# EAGLE design cryoShield (EAGLE 7.1.0)
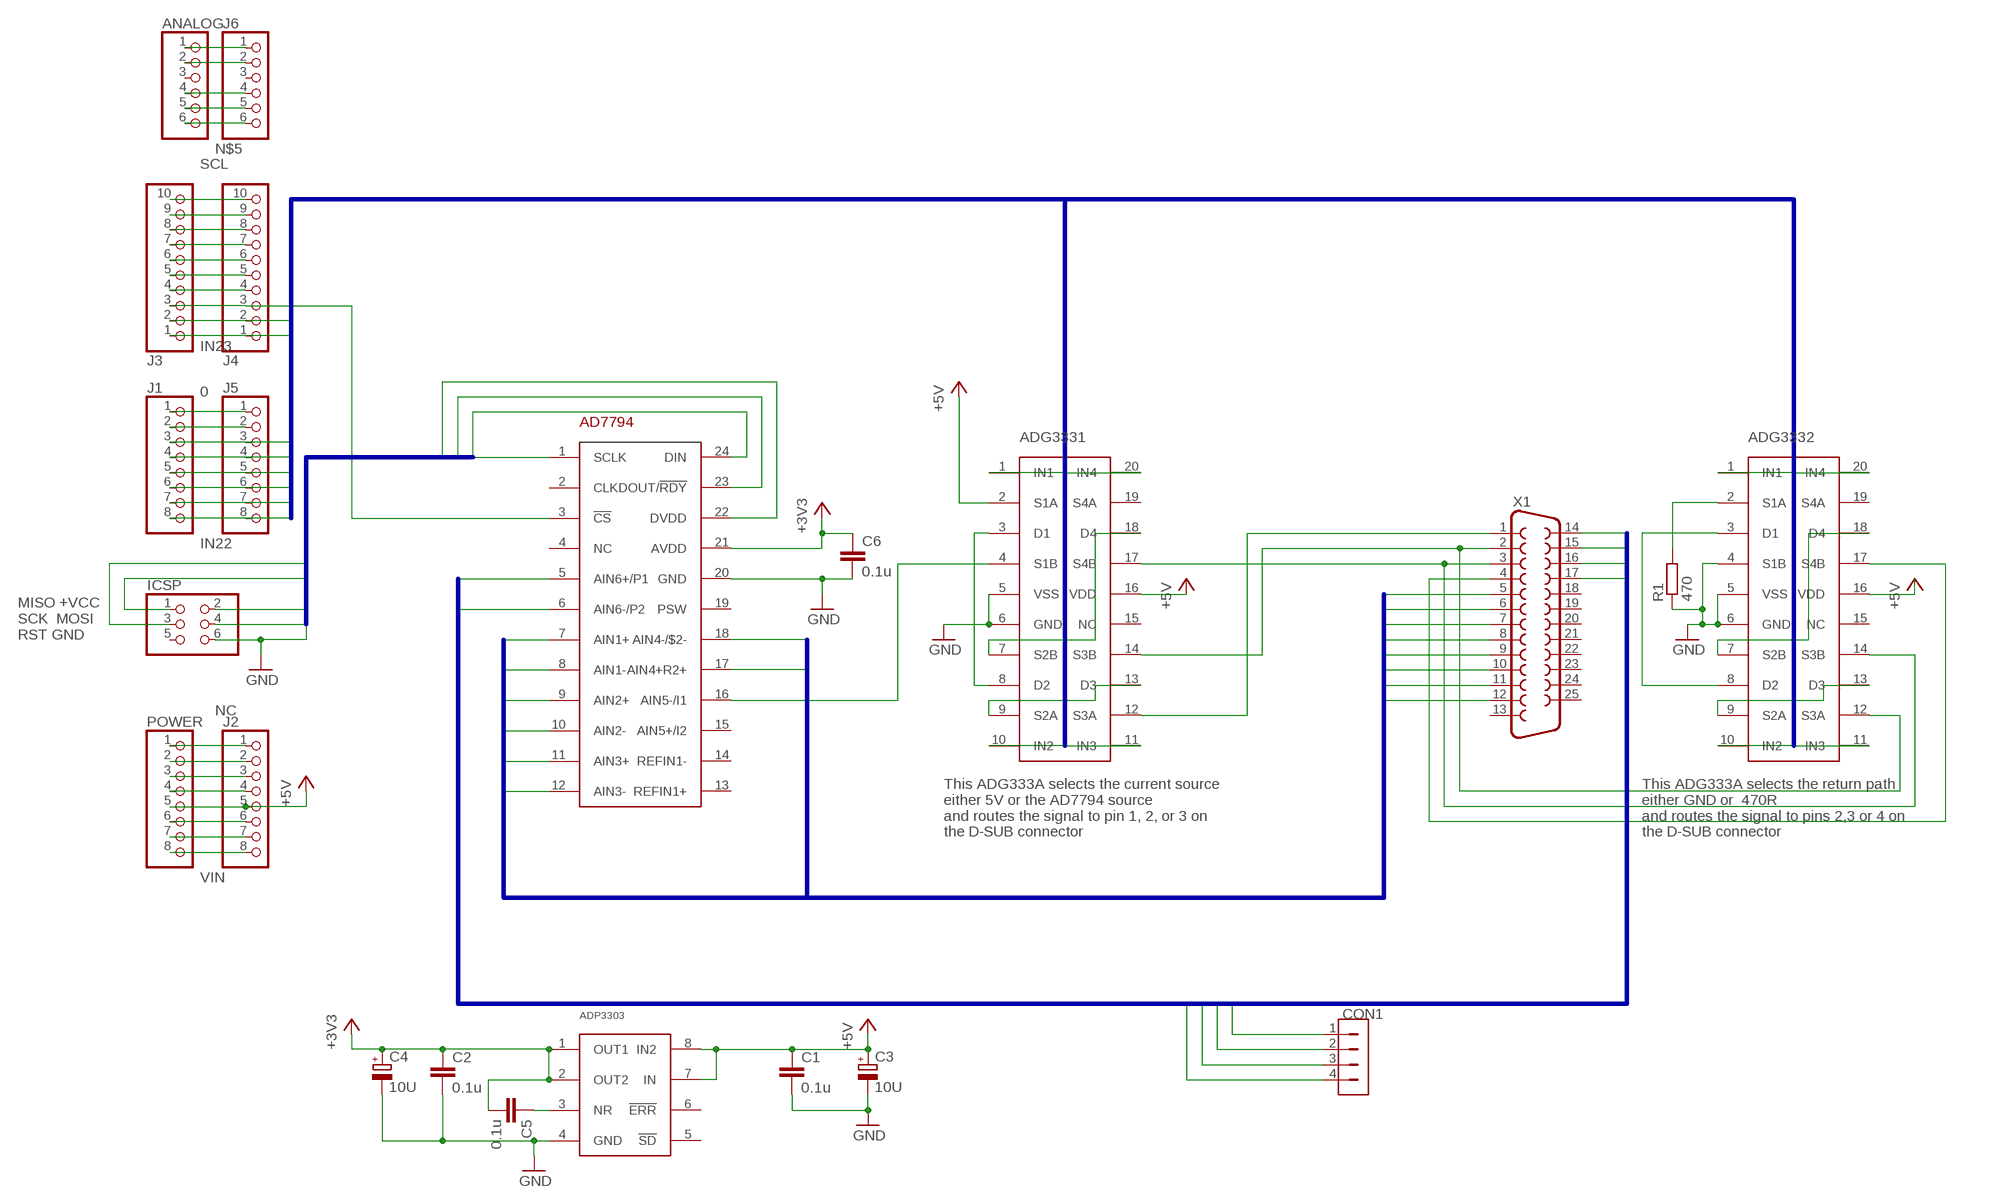
[diagram p0: schematic, sheet 1]

## Parts
AD7794  AD7794  [TSSOP24]
ADG3331  ADG333  [SOIC20S]
ADG3332  ADG333  [SOIC20S]
ADP3303  ADP3303  [SOIC8]
ANALOG  PINHD-1X6  [1X06]
C1  0.1u  C-EUC0805  [C0805]
C2  0.1u  C-EUC0805  [C0805]
C3  10U  CPOL1206  [CPOL1206]
C4  10U  CPOL1206  [CPOL1206]
C5  0.1u  C-EUC0805  [C0805]
C6  0.1u  C-EUC0805  [C0805]
CON1  MICROCLASP4  [MICROCLASP4]
ICSP  PINHD-2X3  [2X03]
J1  PINHD-1X8TH  [1X08-TH]
J2  PINHD-1X8TH  [1X08-TH]
J3  PINHD-1X10TH  [1X10-TH]
J4  PINHD-1X10TH  [1X10-TH]
J5  PINHD-1X8TH  [1X08-TH]
J6  PINHD-1X6  [1X06]
POWER  PINHD-1X8TH  [1X08-TH]
R1  470  R-EU_0207/10  [0207/10]
X1  F25H  [F25H]

## Nets
0: J1.1 J5.1
1: J1.2 J5.2
+3V3: AD7794.21(AVDD) ADP3303.1(OUT1) ADP3303.2(OUT2) C2.1 C4.1(+) C5.2 C6.1 J2.4 POWER.4
+5V: ADG3331.2(S1A) ADG3331.16(VDD) ADG3332.16(VDD) ADP3303.7(IN) ADP3303.8(IN2) C1.1 C3.1(+) J2.5 POWER.5
A0: ANALOG.1 J6.1
A1: ANALOG.2 J6.2
A3: ANALOG.4 J6.4
ADG3332: ADG3332.7(S2B) ADG3332.18(D4)
AIN1+: AD7794.7(AIN1+) X1.5
AIN1-: AD7794.8(AIN1-) X1.6
AIN2+: AD7794.9(AIN2+) X1.7
AIN2-: AD7794.10(AIN2-) X1.8
AIN3+: AD7794.11(AIN3+) X1.9
AIN3-: AD7794.12(AIN3-) X1.10
AIN4+: AD7794.17(AIN4+R2+) X1.11
AIN4-: AD7794.18(AIN4-/$2-) X1.12
AIN6+: AD7794.5(AIN6+/P1) CON1.3 X1.16
AIN6-: AD7794.6(AIN6-/P2) CON1.4 X1.17
CERNOXHIGH: CON1.1 X1.14
CERNOXLOW: CON1.2 X1.15
GND: AD7794.20(GND) ADG3331.5(VSS) ADG3331.6(GND) ADG3332.4(S1B) ADG3332.5(VSS) ADG3332.6(GND) ADP3303.4(GND) C1.2 C2.2 C3.2(-) C4.2(-) C6.2 ICSP.6 J2.6 J2.7 J3.7 J4.7 POWER.6 POWER.7 R1.1
IN11: ADG3331.1(IN1) J1.3 J5.3
IN12: ADG3331.10(IN2) J1.4 J5.4
IN13: ADG3331.11(IN3) J1.5 J5.5
IN14: ADG3331.20(IN4) J1.6 J5.6
IN21: ADG3332.1(IN1) J1.7 J5.7
IN22: ADG3332.10(IN2) J1.8 J5.8
IN23: ADG3332.11(IN3) J3.1 J4.1
IN24: ADG3332.20(IN4) J3.2 J4.2
IOREF: J2.2 POWER.2
MISO: AD7794.23(DOUT/!RDY) ICSP.1
MOSI: AD7794.24(DIN) ICSP.4
N$2: ADG3331.14(S3B) ADG3332.12(S3A) X1.2
N$3: ADG3331.3(D1) ADG3331.8(D2)
N$4: ANALOG.5 J6.5
N$5: ANALOG.6 J6.6
N$6: ADG3331.9(S2A) ADG3331.13(D3)
N$9: ADG3331.7(S2B) ADG3331.18(D4)
N$10: ADG3331.12(S3A) X1.1
N$11: ADG3331.17(S4B) ADG3332.14(S3B) X1.3
N$12: ADG3332.2(S1A) R1.2
N$13: ADG3332.3(D1) ADG3332.8(D2)
N$14: ADG3332.9(S2A) ADG3332.13(D3)
N$16: AD7794.16(AIN5-/I1) ADG3331.4(S1B)
N$17: ADP3303.3(NR) C5.1
N$18: ADG3332.17(S4B) X1.4
N$21: AD7794.3(!CS) J3.3 J4.3
N$22: J3.4 J4.4
N$23: J3.5 J4.5
N$24: J3.6 J4.6
N$26: J3.8 J4.8
NC: J2.1 POWER.1
RESET: J2.3 POWER.3
SCK: AD7794.1(SCLK) ICSP.3
SCL: J3.10 J4.10
SDA: J3.9 J4.9
VCC: AD7794.22(DVDD) ICSP.2
VIN: J2.8 POWER.8
Unconnected: AD7794.2(CLK) AD7794.4(NC) AD7794.13(REFIN1+) AD7794.14(REFIN1-) AD7794.15(AIN5+/I2) AD7794.19(PSW) ADG3331.15(NC) ADG3331.19(S4A) ADG3332.15(NC) ADG3332.19(S4A) ADP3303.5(!SD) ADP3303.6(!ERR) ANALOG.3 ICSP.5 J6.3 X1.13 X1.18 X1.19 X1.20 X1.21 X1.22 X1.23 X1.24 X1.25

## Buses
MISO,VCC,MOSI,SCK,RST,GND
AIN1+,AIN1-,AIN2+,AIN2-,AIN3+,AIN3-,AIN4+,AIN4-
CERNOXHIGH,CERNOXLOW,AIN6+,AIN6-
IN11,IN12,IN13,IN14,IN21,IN22,IN23,IN24

## Notes on the sheet
- MISO +VCC
  SCK  MOSI
  RST GND
- This ADG333A selects the current source
  either 5V or the AD7794 source
  and routes the signal to pin 1, 2, or 3 on
  the D-SUB connector
- This ADG333A selects the return path
  either GND or  470R
  and routes the signal to pins 2,3 or 4 on
  the D-SUB connector

## Library data of the parts
AD7794 = bennosParts:AD7794
ADG3331 ADG3332 = bennosParts:ADG333: ADG333A The ADG333A QUAD SPDT Switch in a PDIP20 package. IN1...IN4 logical inputs Connect Vss to Ground for single supply applications
ADP3303 = bennosParts:ADP3303
ANALOG J6 = pinhead:PINHD-1X6: PIN HEADER
C1 C2 C5 C6 = rcl:C-EU: CAPACITOR, European symbol
C3 C4 = bennosParts:CPOL1206
CON1 = bennosParts:MICROCLASP4: Microclasp 4 Connector RS Order code PCB: 188-103 RS Order code cable terminal: 188-226 RS Order code pre-crimped cables: 188-260
ICSP = SmartPrj:PINHD-2X3: PIN HEADER
J1 J2 J5 POWER = SmartPrj:PINHD-1X8: PIN HEADER
J3 J4 = SmartPrj:PINHD-1X10: PIN HEADER
R1 = rcl:R-EU_: RESISTOR, European symbol
X1 = con-subd:F25: SUB-D; OC_FARNELL: unknown; OC_NEWARK: unknown

## Board
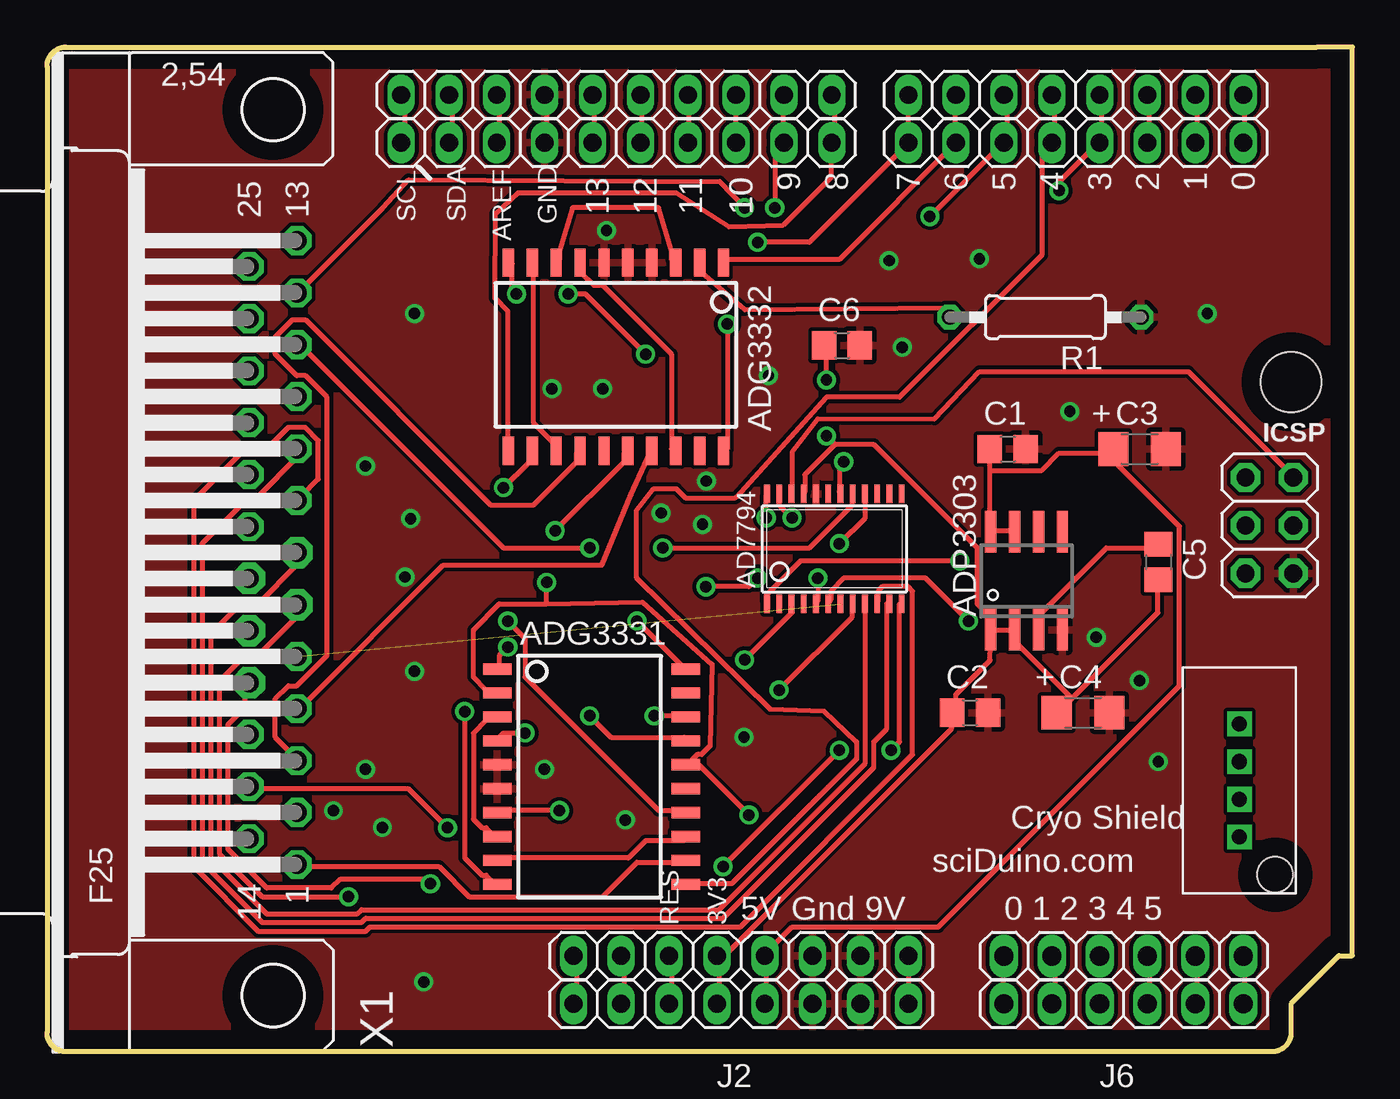
[diagram p1: board, top side]
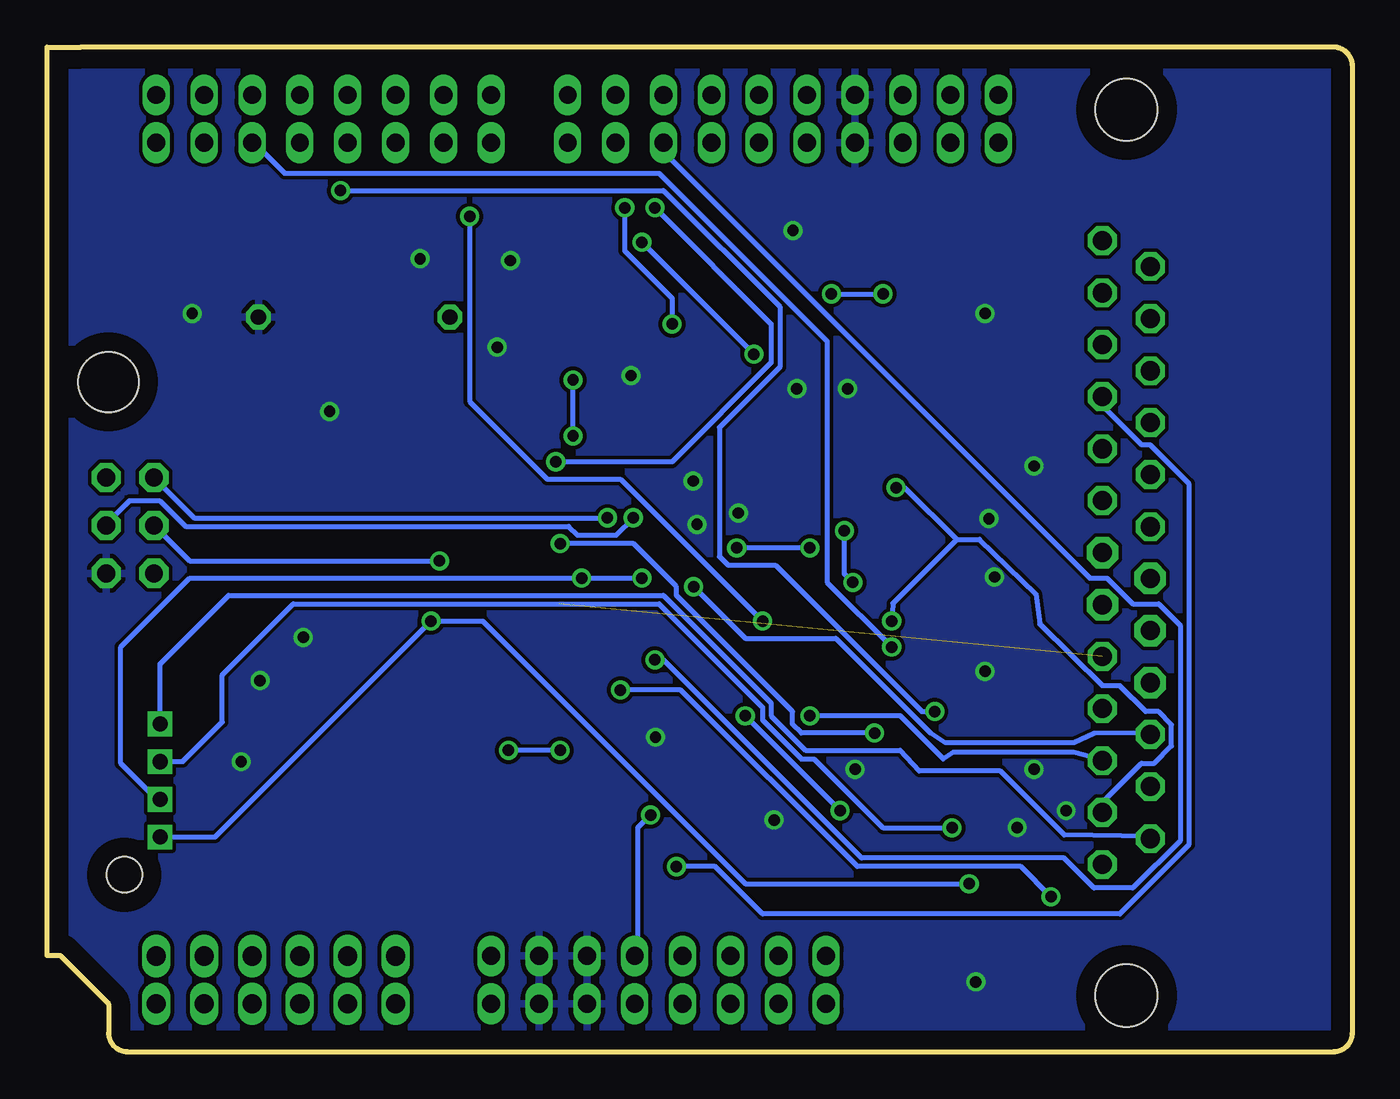
[diagram p2: board, bottom side, seen from below]

Size 69.3 x 53.34 mm. Coordinates in mm from the lower left corner, seen from the top.
Outline: 66.04,1 arc-90 65.04,0
Outline: 1,0 arc-90 0,1
Outline: 0,52.34 arc-90 1,53.34
Outline: 66.04,1 arc-90 65.04,0
Outline: 1,0 arc-90 0,1
Outline: 0,52.34 arc-90 1,53.34
Outline: 66.04,1 arc-90 65.04,0
Outline: 1,0 arc-90 0,1
Outline: 0,52.34 arc-90 1,53.34
Outline: 68.58,5.08 66.04,2.54 66.04,1
Outline: 66.04,1 arc-90 65.04,0
Outline: 65.04,0 1,0
Outline: 1,0 arc-90 0,1
Outline: 0,52.34 arc-90 1,53.34
Outline: 1,53.34 67.42,53.34
Outline: 0,52.32 0,1.02
Outline: 68.6,5.1 69.3,5.1 69.3,53.34 67.5,53.34
Copper layers (1*16): Top 0.035mm / dielectric 1.5mm / Bottom 0.035mm
Design rules "default": minimum track width 10mil, minimum drill 24mil, track to track 8mil, track to pad 8mil, pad to pad 8mil, via to via 8mil, smd to smd 8mil, copper to edge 40mil, drill to drill 8mil, minimum pad ring 10mil, minimum via ring 8mil, stop-mask expansion 2mil, vias tented up to drill 0mil, thermal gap 10mil
Holes 3.2 mm at 66.04,35.56

### Footprints (pad centres in the part's own frame; a part is rotated, then mirrored left to right if it is on the bottom)
TSSOP24 = smd 0.305 x 0.991: 1 -3.575,-2.918; 2 -2.925,-2.918; 3 -2.275,-2.918; 4 -1.625,-2.918; 5 -0.975,-2.918; 6 -0.325,-2.918; 7 0.325,-2.918; 8 0.975,-2.918; 9 1.625,-2.918; 10 2.275,-2.918; 11 2.925,-2.918; 12 3.575,-2.918; 13 3.575,2.918; 14 2.925,2.918; 15 2.275,2.918; 16 1.625,2.918; 17 0.975,2.918; 18 0.325,2.918; 19 -0.325,2.918; 20 -0.975,2.918; 21 -1.625,2.918; 22 -2.275,2.918; 23 -2.925,2.918; 24 -3.575,2.918
SOIC20S = smd 0.6 x 1.5: 1 -5.715,-5; 2 -4.445,-5; 3 -3.175,-5; 4 -1.905,-5; 5 -0.635,-5; 6 0.635,-5; 7 1.905,-5; 8 3.175,-5; 9 4.445,-5; 10 5.715,-5; 11 5.715,5; 12 4.445,5; 13 3.175,5; 14 1.905,5; 15 0.635,5; 16 -0.635,5; 17 -1.905,5; 18 -3.175,5; 19 -4.445,5; 20 -5.715,5
SOIC8 = smd 0.6 x 2.2: 1 -1.905,-2.6; 2 -0.635,-2.6; 3 0.635,-2.6; 4 1.905,-2.6; 5 1.905,2.6; 6 0.635,2.6; 7 -0.635,2.6; 8 -1.905,2.6
1X06 = drill 1.016 long: 1 -6.35,0; 2 -3.81,0; 3 -1.27,0; 4 1.27,0; 5 3.81,0; 6 6.35,0
C0805 = smd 1.3 x 1.5: 1 -0.95,0; 2 0.95,0
CPOL1206 = smd 1.6 x 1.8: 1 -1.4,0; 2 1.4,0
MICROCLASP4 = drill 0.8 square: 1 -3,0; 2 -1,0; 3 1,0; 4 3,0 | hole 1.9: 5,1.9
2X03 = drill 0.95 pad 1.55 octagon: 1 -2.54,-1.27; 2 -2.54,1.27; 3 0,-1.27; 4 0,1.27; 5 2.54,-1.27; 6 2.54,1.27
1X08-TH = drill 0.95 pad 1.422 long: 1 -8.89,0; 2 -6.35,0; 3 -3.81,0; 4 -1.27,0; 5 1.27,0; 6 3.81,0; 7 6.35,0; 8 8.89,0
1X10-TH = drill 0.95 pad 1.422 long: 1 -11.43,0; 2 -8.89,0; 3 -6.35,0; 4 -3.81,0; 5 -1.27,0; 6 1.27,0; 7 3.81,0; 8 6.35,0; 9 8.89,0; 10 11.43,0
0207/10 = drill 0.813 octagon: 1 -5.08,0; 2 5.08,0
F25H = drill 1.016 octagon: 1 -16.561,-1.27; 2 -13.792,-1.27; 3 -11.049,-1.27; 4 -8.28,-1.27; 5 -5.512,-1.27; 8 2.769,-1.27; 9 5.512,-1.27; 10 8.28,-1.27; 11 11.049,-1.27; 12 13.792,-1.27; 13 16.561,-1.27; 14 -15.189,1.27; 15 -12.421,1.27; 16 -9.652,1.27; 20 1.372,1.27; 21 4.14,1.27; 22 6.909,1.27; 23 9.652,1.27; 24 12.421,1.27; 25 15.189,1.27 | drill 1.016 pad 1.67 octagon: 6 -2.769,-1.27; 7 0,-1.27; 17 -6.909,1.27; 18 -4.14,1.27; 19 -1.372,1.27 | hole 3.302: -23.52,0; 23.52,0

### Placement (x,y rotation side)
AD7794  41.8,26.7 0 top
ADG3331  28.9,14.6 270 top
ADG3332  30.2,36.9 180 top
ADP3303  52,25 0 top
ANALOG  57.15,2.54 0 top
C1  51,32 0 top
C2  49,18 0 top
C3  58,32 0 top
C4  55,18 0 top
C5  59,26 270 top
C6  42.2,37.5 0 top
CON1  63.3,14.4 270 top
ICSP  64.9,27.94 270 top
J1  54.61,50.8 180 top
J2  36.83,2.54 0 top
J3  30.23,50.8 180 top
J4  30.23,48.26 180 top
J5  54.61,48.26 180 top
J6  57.15,5.08 0 top
POWER  36.83,5.08 0 top
R1  53,39 180 top
X1  12,26.5 90 top

### Tracks (layer width: path | path; a pad name or v marks a point on that pad's centre or on a via)
0
  Top 0.254: J5.1 63.55,48.46 63.55,50.75 J1.1
1
  Top 0.254: J5.2 61.04,48.46 61.04,50.75 J1.2
+3V3  (via drill 0.61)
  Top 0.254: 54.41,18.75 53.72,18.06 C4.1 | 54.41,18.75 58.98,23.32 58.98,24.92 C5.2 | J2.4 35.66,2.74 35.66,5.03 POWER.4 35.66,5.26 36.12,5.26 48.01,17.14 48.01,17.83 C2.1 48.23,18.06 48.23,18.95 50.06,20.77 ADP3303.1 | 41.83,32.23 40.23,30.63 40.23,29.72 AD7794.21 | 41.83,32.23 43.89,32.23 49.38,26.75 49.38,23.77 50.06,23.09 50.06,22.4 ADP3303.1 | v41.38,35.66 41.38,37.49 C6.1 | 41.83,32.23 v41.38,32.69 | ADP3303.1 50.29,22.4 51.21,22.4 ADP3303.2 51.44,22.17 51.44,21.72 54.41,18.75
  Bottom 0.254: v41.38,32.69 v41.38,35.66
+5V  (via drill 0.61)
  Top 0.254: 50.06,30.86 50.06,27.66 ADP3303.8 50.29,27.66 51.21,27.66 ADP3303.7 | 50.06,30.86 50.06,31.77 C1.1 | 50.06,30.86 52.81,30.86 53.72,31.77 56.46,31.77 C3.1 56.69,31.77 56.69,31.32 60.12,27.89 60.12,19.43 47.32,6.63 39.55,6.63 38.18,5.26 POWER.5 38.18,5.03 38.18,2.74 J2.5 | 34.29,15.54 34.52,15.77 34.75,15.77 35.2,16.23 35.3,20.57 31.6,23.87 26.52,23.77 | 34.29,15.54 34.06,15.32 ADG3331.16 | 26.52,23.77 24,23.77 22.63,22.4 22.63,19.89 23.32,19.2 23.77,19.2 ADG3331.2 | v26.98,27.66 30.63,31.32 30.63,31.77 ADG3332.16 | 26.52,23.77 v26.52,24.92 | 34.29,15.54 v37.26,12.57
  Bottom 0.254: v26.98,27.66 26.98,25.38 v26.52,24.92 | v37.26,12.57 37.95,11.89 37.95,5.26 POWER.5
A0
  Top 0.254: ANALOG.1 50.75,2.74 50.75,5.03 J6.1
A1
  Top 0.254: ANALOG.2 53.49,2.74 53.49,5.03 J6.2
A3
  Top 0.254: ANALOG.4 58.52,2.74 58.52,5.03 J6.4
ADG3332
  Top 0.254: ADG3332.18 33.15,32 33.15,37.03 29.49,40.69 29.03,40.69 28.35,41.38 28.35,41.83 ADG3332.7
AIN1+  (1 unrouted)
AIN1-  (via drill 0.61)
  Top 0.254: v38.86,19.2 42.75,23.09 42.75,23.77 AD7794.8 | v16,8.23 11.43,8.23 9.14,10.52 9.14,19.66 10.52,21.03 11.2,21.03 13.26,23.09 13.26,23.55 X1.6
  Bottom 0.254: v38.86,19.2 35.66,19.2 26.29,9.83 17.6,9.83 v16,8.23
AIN2+
  Top 0.254: AD7794.9 43.43,23.77 43.43,15.32 35.66,7.54 16.69,7.54 16.46,7.32 11.66,7.32 8.69,10.29 8.69,22.17 10.29,23.77 11.2,23.77 13.26,25.83 13.26,26.29 X1.7
AIN2-
  Top 0.254: AD7794.10 44.12,24 44.12,24.46 44.35,24.69 45.72,24.69 45.95,24.46 45.95,15.77 36.8,6.63 17.14,6.63 16.92,6.4 11.2,6.4 7.77,9.83 7.77,29.26 10.74,32.23 11.89,32.23 12.8,33.15 13.72,33.15 14.4,32.46 14.4,30.4 13.49,29.49 X1.8
AIN3+
  Top 0.254: AD7794.11 44.58,23.77 44.58,17.14 43.89,16.46 43.89,15.09 35.89,7.09 16.92,7.09 16.69,6.86 11.43,6.86 8.23,10.06 8.23,26.98 10.74,29.49 11.2,29.49 13.26,31.55 X1.9
AIN3-  (via drill 0.61)
  Top 0.254: v44.81,16 45.26,16.46 45.26,23.77 AD7794.12 | v35.89,9.83 v42.06,16
  Bottom 0.254: v42.06,16 v44.81,16 | v35.89,9.83 33.83,9.83 31.32,7.32 12.34,7.32 8.69,10.97 8.69,30.18 10.74,32.23 11.2,32.23 13.26,34.29 13.26,34.75 X1.10
AIN4+  (via drill 0.61)
  Top 0.254: v32.69,26.75 40.46,26.75 42.75,29.03 42.75,29.49 AD7794.17 | v28.8,26.75 24.23,26.75 13.49,37.49 X1.11
  Bottom 0.254: v28.8,26.75 v32.69,26.75
AIN4-  (via drill 0.61)
  Top 0.254: v42.29,31.32 42.06,31.09 42.06,29.72 AD7794.18 | X1.12 13.49,40.46 17.83,44.81 19.2,46.3 35.7,46.2 v37.03,44.81
  Bottom 0.254: v42.29,31.32 36.12,31.32 30.86,36.58 30.86,38.63 v37.03,44.81
AIN6+  (via drill 0.61)
  Top 0.254: v40.92,25.15 40.92,24 AD7794.5 | v34.98,24.69 37.26,24.69 v37.72,25.15
  Bottom 0.254: v34.98,24.69 32.23,21.95 27.43,21.95 22.4,16.92 21.6,16.4 14.8,16.4 13.7,16.9 10.74,16.92 X1.16 | v37.72,25.15 v40.92,25.15 61.72,25.15 65.38,21.49 65.38,15.32 63.36,13.3 63.3,13.3 CON1.3
AIN6-  (via drill 0.61)
  Top 0.254: v48.92,22.86 46.63,25.15 42.29,25.15 41.6,24.46 41.6,24 AD7794.6 | v20.34,8.91 20.12,9.14 15.54,9.14 15.09,8.69 11.66,8.69 9.6,10.74 9.6,17.37 10.52,18.29 10.52,19.43 X1.17
  Bottom 0.254: v20.34,8.91 32.23,8.91 46.18,22.86 v48.92,22.86 60.38,11.4 CON1.4
CERNOXHIGH
  Bottom 0.254: X1.14 10.74,11.43 15.3,11.5 18.7,14.9 23,14.9 24,16 29.03,16 30.86,17.83 30.86,18.52 36.58,24.23 59.66,24.23 63.3,20.6 CON1.1
CERNOXLOW  (via drill 0.61)
  Top 0.254: v21.26,11.89 19.2,13.95 10.74,13.95 X1.15
  Bottom 0.254: v21.26,11.89 24.92,11.89 28.57,15.54 29.26,15.54 31.32,17.6 31.32,18.29 36.8,23.77 56.24,23.77 60,20.01 60,17.5 62.1,15.4 CON1.2
GND  (via drill 0.6)
  Top 0.254: J4.7 26.52,48.46 26.52,50.75 J3.7
  other vias: 30.7,12.3 37,16.7 19.5,39.2 19.3,28.3 19.5,20.2 61.6,39.2 54.3,34 49.5,42.1 44.7,42 45.4,37.4 58,19.7 55.7,22 34.8,28 38.3,35.9 32.6,28.6 29.5,35.2 26.8,35.2 29.7,43.6 16.9,31.1 26.4,15 20,3.7 17.8,11.9 15.2,12.8 16.9,15 19,25.2 35,30.3 59,15.4
  pour Bottom: 69.22,53.59 69.22,-0.38 -0.13,-0.38 -0.13,53.72
  pour Top: -0.38,53.72 69.22,53.72 69.22,-0.89 -0.38,-0.89
IN11  (via drill 0.61)
  Top 0.254: v24.46,21.49 24,21.03 24,20.34 ADG3331.1 | J1.3 58.52,50.75 58.52,48.46 J5.3
  Bottom 0.254: v24.46,21.49 27.89,24.92 27.89,37.72 36.8,46.63 56.69,46.63 58.29,48.23 J5.3
IN12  (via drill 0.61)
  Top 0.254: v22.17,18.06 22.17,10.29 23.09,9.37 23.32,9.37 23.77,8.91 ADG3331.10 | v53.72,45.72 53.72,46.18 55.78,48.23 J5.4 56.01,48.46 56.01,50.75 J1.4
  Bottom 0.254: v22.17,18.06 22.86,18.06 30.63,25.83 33.15,25.83 33.6,26.29 33.6,33.15 30.4,36.35 30.4,39.55 36.58,45.72 v53.72,45.72
IN13
  Top 0.254: ADG3331.11 34.06,8.91 36.35,8.91 42.98,15.54 42.98,16.46 41.25,18.09 38.38,18.19 31.27,25.19 31.27,28.7 32.2,29.9 33.4,29.9 33.9,29.4 36.53,29.4 36.56,29.43 41.38,34.75 45.26,34.75 52.81,42.29 52.81,47.78 53.26,48.23 J5.5 53.49,48.46 53.49,50.75 J1.5
IN14  (via drill 0.61)
  Top 0.254: v31.32,22.86 33.83,20.34 ADG3331.20 | v46.86,44.35 50.75,48.23 J5.6 50.98,48.46 50.98,50.75 J1.6
  Bottom 0.254: v31.32,22.86 38.86,30.4 42.75,30.4 46.86,34.52 v46.86,44.35
IN21
  Top 0.254: ADG3332.1 36.12,42.06 42.06,42.06 J5.7 48.23,48.46 48.23,50.75 J1.7
IN22  (via drill 0.61)
  Top 0.254: v24.92,40.23 24.69,40.46 24.69,41.83 ADG3332.10 | v27.66,40.23 28.57,40.23 v31.77,37.03 | v37.72,42.98 40.46,42.98 45.72,48.23 J5.8 J1.8
  Bottom 0.254: v27.66,40.23 v24.92,40.23 | v37.72,42.98 v31.77,37.03
IN23
  Top 0.254: ADG3332.11 24.46,32 24.46,39.32 23.77,40.01 23.8,44.5 25,45.6 33.4,45.6 36.2,43.8 39.09,43.89 41.6,46.41 41.6,48.23 J4.1 41.83,48.46 41.83,50.75 J3.1
IN24  (via drill 0.61)
  Top 0.254: v36.12,38.63 36.12,32 ADG3332.20 | v38.63,44.81 38.63,47.78 J4.2 39.09,48.46 39.09,50.75 J3.2
  Bottom 0.254: v36.12,38.63 36.12,40.01 38.63,42.52 v38.63,44.81
IOREF
  Top 0.254: J2.2 30.63,2.74 30.63,5.03 POWER.2
MISO  (via drill 0.61)
  Top 0.254: v39.55,28.35 38.86,29.03 38.86,29.49 AD7794.23
  Bottom 0.254: v39.55,28.35 61.49,28.35 ICSP.1
MOSI  (via drill 0.61)
  Top 0.254: v38.18,28.35 38.18,29.49 AD7794.24
  Bottom 0.254: v38.18,28.35 39.09,27.43 41.15,27.43 41.6,27.89 61.95,27.89 63.32,29.26 64.92,29.26 66.06,28.12 ICSP.4
N$2  (via drill 0.61)
  Top 0.254: v24.23,29.95 25.6,31.32 25.6,31.77 ADG3332.12 | v24.46,22.86 25.38,21.95 25.38,19.89 32.46,12.8 33.83,12.8 ADG3331.14
  Bottom 0.254: v24.23,29.95 23.77,29.95 21,27.2 | X1.2 13.26,12.8 13.26,13.26 11.2,15.32 10.52,15.32 9.6,16.23 9.6,17.37 10.29,18.06 10.97,18.06 12.34,19.43 13.26,19.43 16.6,22.7 16.8,24.3 19.8,27.2 21,27.2 | 21,27.2 24.4,23.8 v24.46,22.86
N$3
  Top 0.254: ADG3331.8 23.77,11.43 23.32,11.89 23.09,11.89 22.63,12.34 22.63,16.92 23.32,17.6 23.77,17.6 ADG3331.3
N$4
  Top 0.254: ANALOG.5 61.04,2.74 61.04,5.03 J6.5
N$5
  Top 0.254: ANALOG.6 63.55,2.74 63.55,5.03 J6.6
N$6
  Top 0.254: ADG3331.9 24,10.29 30.86,10.29 31.77,11.2 33.83,11.2 ADG3331.13
N$9  (via drill 0.61)
  Top 0.254: v27.2,12.8 24,12.8 ADG3331.7 | v32.23,17.83 33.83,17.83 ADG3331.18
  Bottom 0.254: v32.23,17.83 v27.2,12.8
N$10
  Top 0.254: ADG3331.12 33.83,10.06 31.32,10.06 29.49,8.23 22.4,8.23 20.8,9.83 13.49,9.83 X1.1
N$11  (via drill 0.61)
  Top 0.254: v28.8,17.83 29.95,16.69 33.83,16.69 ADG3331.17 | ADG3332.14 28.12,31.77 28.12,31.32 25.83,29.03 23.55,29.03 13.72,38.86 13.03,38.86 12.12,37.95 12.12,37.03 13.26,35.89 13.72,35.89 14.86,34.75 14.86,21.03 13.26,19.43 12.8,19.43 12.12,18.75 12.12,16.69 13.26,15.54 X1.3
  Bottom 0.254: v28.8,17.83 24,17.83 21.72,15.54 21.2,15.9 14.8,15.9 13.49,15.54 X1.3
N$12
  Top 0.254: ADG3332.2 34.75,41.83 34.75,41.38 37.03,39.39 47.91,39.51 R1.2
N$13
  Top 0.254: ADG3332.8 27.2,42.06 27.2,42.52 27.89,44.8 32.46,44.8 33.15,42.52 33.15,42.06 ADG3332.3
N$14
  Top 0.254: ADG3332.9 25.83,41.83 25.83,33.38 27.2,32 ADG3332.13
N$16  (via drill 0.61)
  Top 0.254: v42.06,26.98 43.43,28.35 43.43,29.49 AD7794.16 | v25.38,16.92 24.23,16.92 24,16.69 ADG3331.4
  Bottom 0.254: v42.06,26.98 38.18,26.98 35.89,24.69 35.89,24.23 29.72,18.06 29.72,17.37 29.26,16.92 v25.38,16.92
N$17
  Top 0.254: C5.1 58.98,26.75 56.24,26.75 52.81,23.32 52.81,22.4 ADP3303.3
N$18
  Top 0.254: ADG3332.17 32,31.77 31,29.57 29.46,25.83 21.03,25.83 13.49,18.29 X1.4
N$21  (via drill 0.61)
  Top 0.254: v37.03,20.8 39.55,23.32 39.55,23.77 AD7794.3 | J4.3 J3.3
  Bottom 0.254: v37.03,20.8 36.58,20.8 26.06,10.29 15.32,10.29 13.72,8.69 11.66,8.69 9.14,11.2 9.14,22.63 10.29,23.77 11.66,23.77 13.03,25.15 13.95,25.15 36.58,47.78 J4.3
N$22
  Top 0.254: J4.4 34.06,48.46 34.06,50.75 J3.4
N$23
  Top 0.254: J4.5 31.55,48.46 31.55,50.75 J3.5
N$24
  Top 0.254: J4.6 29.03,48.46 29.03,50.75 J3.6
N$26
  Top 0.254: J4.8 24,48.46 24,50.75 J3.8
NC
  Top 0.254: J2.1 28.12,2.74 28.12,5.03 POWER.1
RESET
  Top 0.254: J2.3 33.15,2.74 33.15,5.03 POWER.3
SCK  (via drill 0.61)
  Top 0.254: v48.46,26.06 40.01,26.06 38.18,24.23 38.18,24 AD7794.1
  Bottom 0.254: v48.46,26.06 61.72,26.06 63.55,27.89 ICSP.3
SCL
  Top 0.254: J4.10 18.97,48.46 18.97,50.75 J3.10
SDA
  Top 0.254: J4.9 21.49,48.46 21.49,50.75 J3.9
VCC
  Top 0.254: AD7794.22 39.55,29.72 39.55,31.83 40.92,33.6 47.1,33.6 49.5,36.1 60.6,36.1 63.09,33.6 66.06,30.63 ICSP.2
VIN
  Top 0.254: POWER.8 J2.8

### Text on the board
tPlace: 9 | 8 | 7 | 6 | 5 | 4 | 3 | 2 | 1 | 0 | 13 | 12 | 11 | 10 | 10 | Cryo Shield | sciDuino.com
tNames: SCL | SDA | GND | AREF | RES | 3V3 | 5V Gnd 9V | 0 1 2 3 4 5
bStop: SDA | AREF | GND